# Altium schematic sheet Page06 CPU IO.SchDoc
size 513 x 386 mm
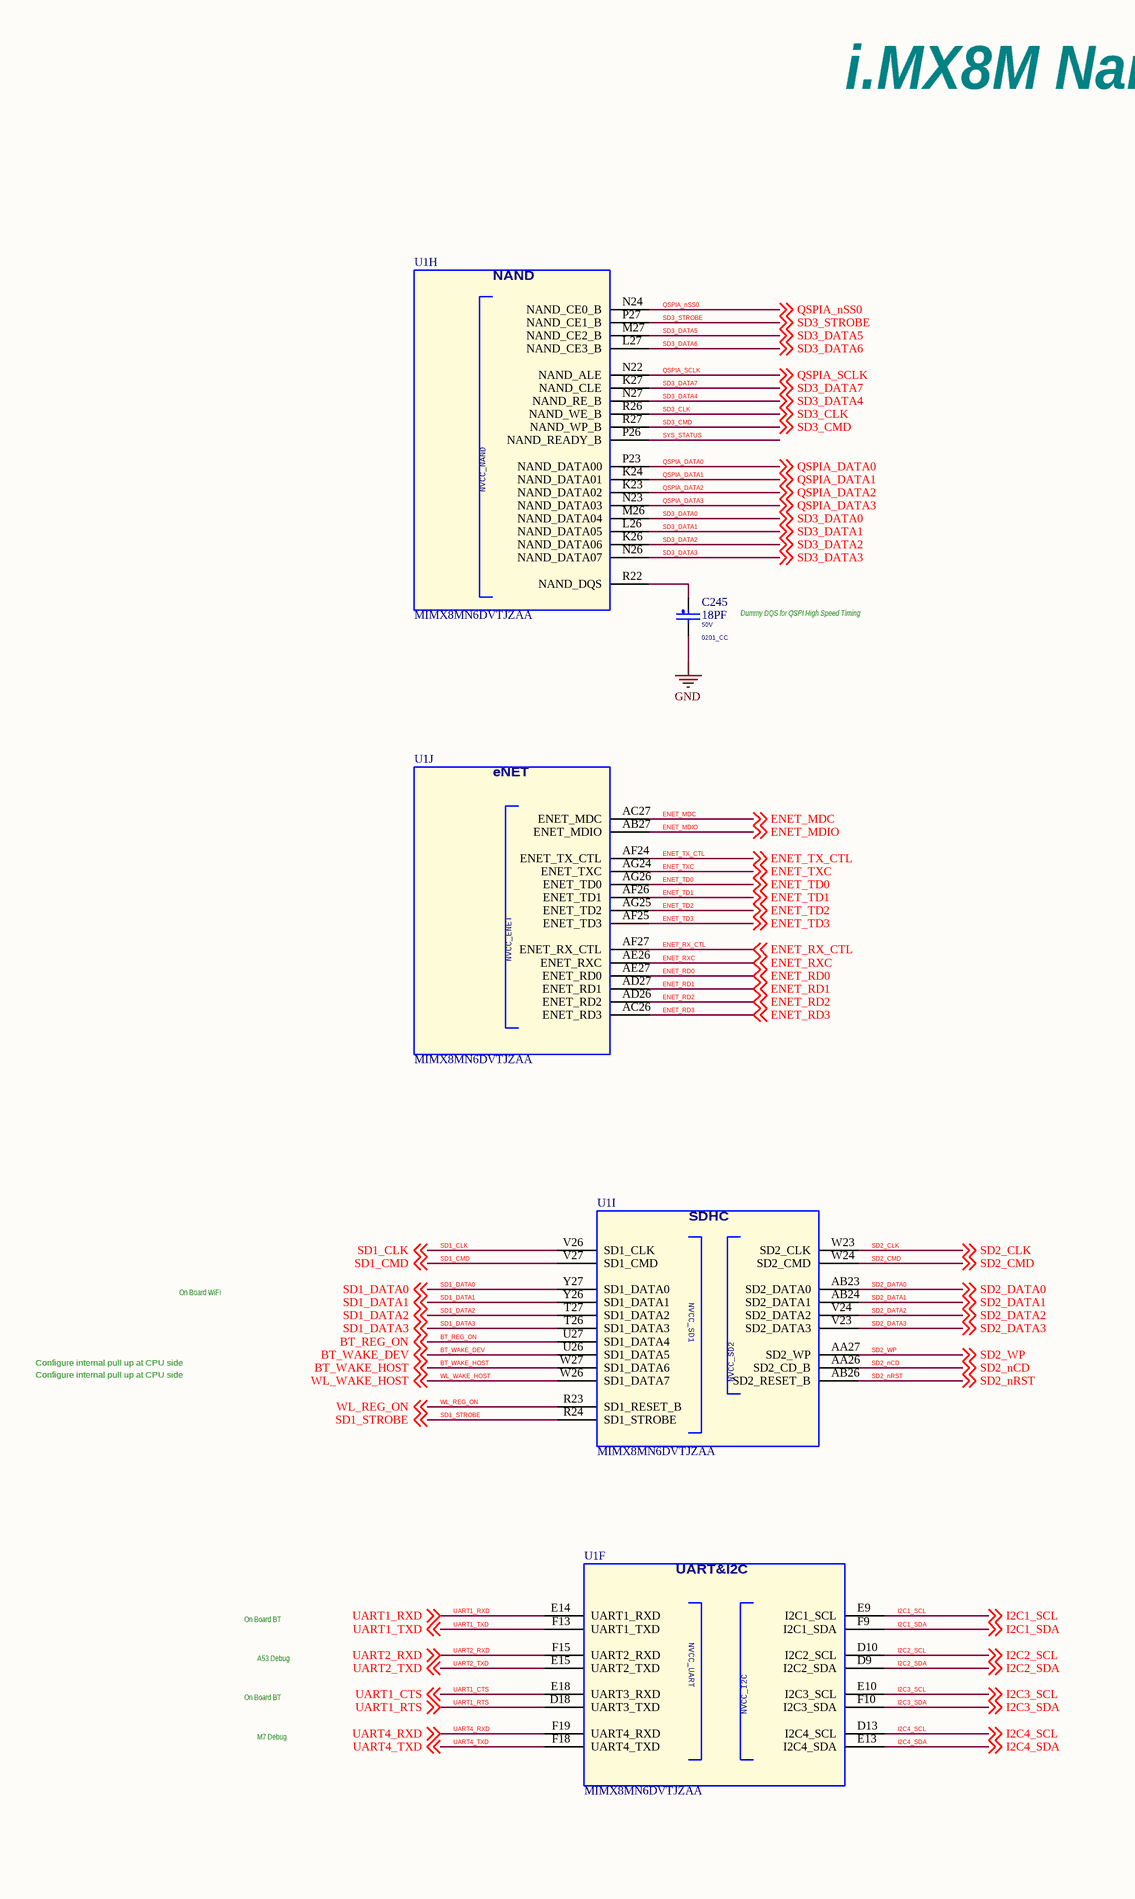
[diagram p0: Page06 CPU IO.SchDoc, left]
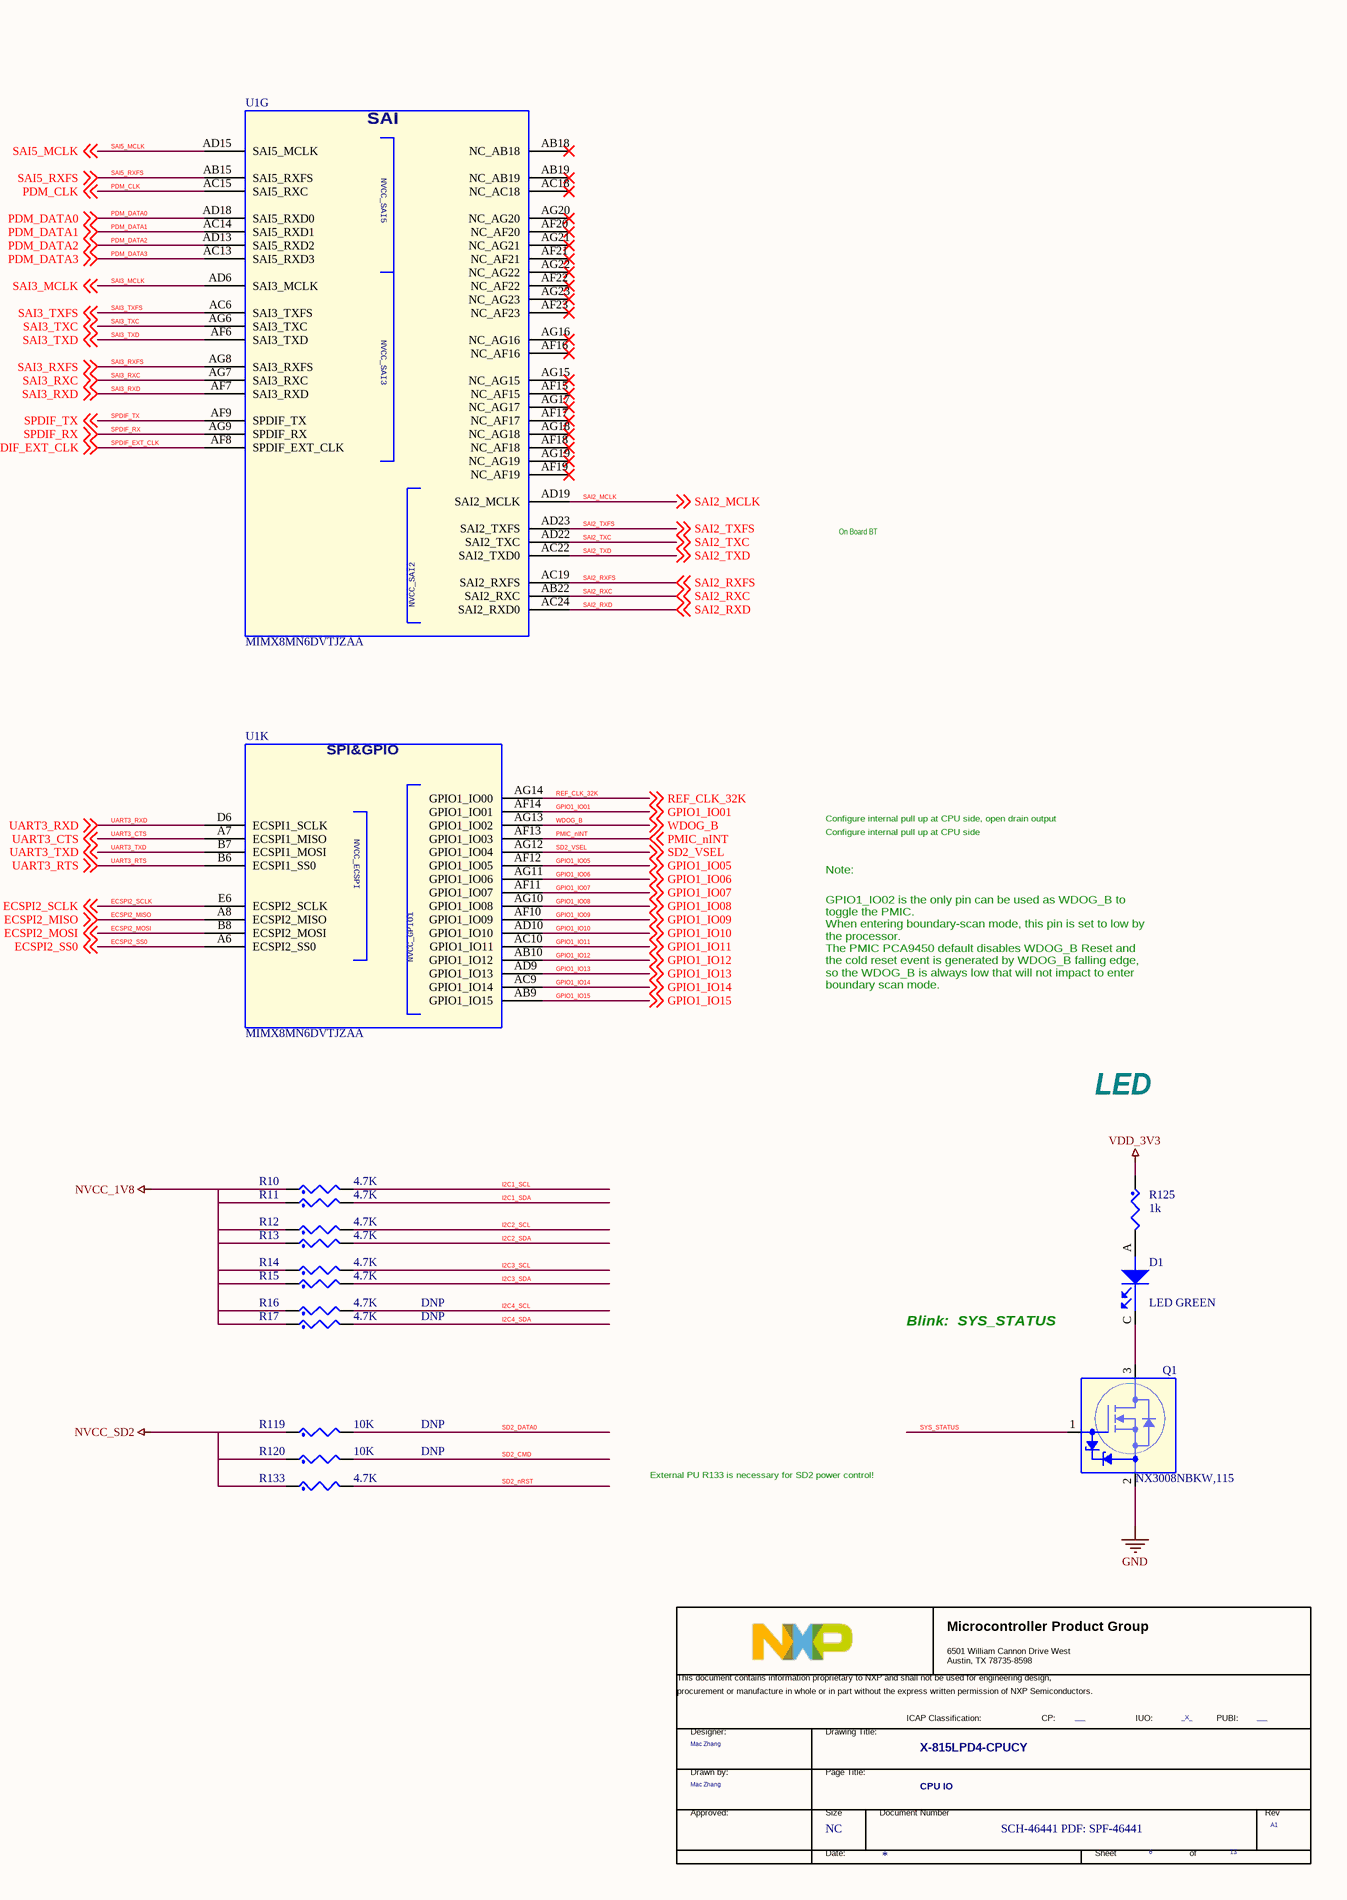
[diagram p1: Page06 CPU IO.SchDoc, right]

## Parts
*  Doc: SCH-46441 PDF: SPF-46441  RevCode: A1  Title: X-815LPD4-CPUCY  Page Size: NC  Page Number: 6  Page Count: 13  PageTitle: CPU IO  Designer: Mac Zhang  PUBI: ___  FIUO: _X_  (hidden comment: TitleBlock_MCPG)  (graphical)
C245  18PF  VOLTAGE: 50V  [0201_CC]
D1  LED GREEN  [LED_0603]
Q1  NX3008NBKW,115  [sc70_3]
R10  4.7K  [0201_CC]
R11  4.7K  [0201_CC]
R12  4.7K  [0201_CC]
R13  4.7K  [0201_CC]
R14  4.7K  [0201_CC]
R15  4.7K  [0201_CC]
R16  4.7K  ASSY_OPT: DNP  [0201_CC]
R17  4.7K  ASSY_OPT: DNP  [0201_CC]
R119  10K  ASSY_OPT: DNP  [0201_CC]
R120  10K  ASSY_OPT: DNP  [0201_CC]
R125  1k  [0201_CC]
R133  4.7K  [0201_CC]
U1  MIMX8MN6DVTJZAA  [bga486_0p5_14x14]  (parts F,G,H,I,J,K of 14)

## Nets
GND: C245.2 Q1.2(SOURCE)
NVCC_1V8: R10.1 R11.1 R12.1 R13.1 R14.1 R15.1 R16.1 R17.1
NVCC_SD2: R119.1 R120.1 R133.1
VDD_3V3: R125.1
BT_REG_ON: U1.U27(SD1_DATA4) ; off-sheet BT_REG_ON
BT_WAKE_DEV: U1.U26(SD1_DATA5) ; off-sheet BT_WAKE_DEV
BT_WAKE_HOST: U1.W27(SD1_DATA6) ; off-sheet BT_WAKE_HOST
ECSPI2_MISO: U1.A8(ECSPI2_MISO) ; off-sheet ECSPI2_MISO
ECSPI2_MOSI: U1.B8(ECSPI2_MOSI) ; off-sheet ECSPI2_MOSI
ECSPI2_SCLK: U1.E6(ECSPI2_SCLK) ; off-sheet ECSPI2_SCLK
ECSPI2_SS0: U1.A6(ECSPI2_SS0) ; off-sheet ECSPI2_SS0
ENET_MDC: U1.AC27(ENET_MDC) ; off-sheet ENET_MDC
ENET_MDIO: U1.AB27(ENET_MDIO) ; off-sheet ENET_MDIO
ENET_RD0: U1.AE27(ENET_RD0) ; off-sheet ENET_RD0
ENET_RD1: U1.AD27(ENET_RD1) ; off-sheet ENET_RD1
ENET_RD2: U1.AD26(ENET_RD2) ; off-sheet ENET_RD2
ENET_RD3: U1.AC26(ENET_RD3) ; off-sheet ENET_RD3
ENET_RX_CTL: U1.AF27(ENET_RX_CTL) ; off-sheet ENET_RX_CTL
ENET_RXC: U1.AE26(ENET_RXC) ; off-sheet ENET_RXC
ENET_TD0: U1.AG26(ENET_TD0) ; off-sheet ENET_TD0
ENET_TD1: U1.AF26(ENET_TD1) ; off-sheet ENET_TD1
ENET_TD2: U1.AG25(ENET_TD2) ; off-sheet ENET_TD2
ENET_TD3: U1.AF25(ENET_TD3) ; off-sheet ENET_TD3
ENET_TX_CTL: U1.AF24(ENET_TX_CTL) ; off-sheet ENET_TX_CTL
ENET_TXC: U1.AG24(ENET_TXC) ; off-sheet ENET_TXC
GPIO1_IO01: U1.AF14(GPIO1_IO01) ; off-sheet GPIO1_IO01
GPIO1_IO05: U1.AF12(GPIO1_IO05) ; off-sheet GPIO1_IO05
GPIO1_IO06: U1.AG11(GPIO1_IO06) ; off-sheet GPIO1_IO06
GPIO1_IO07: U1.AF11(GPIO1_IO07) ; off-sheet GPIO1_IO07
GPIO1_IO08: U1.AG10(GPIO1_IO08) ; off-sheet GPIO1_IO08
GPIO1_IO09: U1.AF10(GPIO1_IO09) ; off-sheet GPIO1_IO09
GPIO1_IO10: U1.AD10(GPIO1_IO10) ; off-sheet GPIO1_IO10
GPIO1_IO11: U1.AC10(GPIO1_IO11) ; off-sheet GPIO1_IO11
GPIO1_IO12: U1.AB10(GPIO1_IO12) ; off-sheet GPIO1_IO12
GPIO1_IO13: U1.AD9(GPIO1_IO13) ; off-sheet GPIO1_IO13
GPIO1_IO14: U1.AC9(GPIO1_IO14) ; off-sheet GPIO1_IO14
GPIO1_IO15: U1.AB9(GPIO1_IO15) ; off-sheet GPIO1_IO15
I2C1_SCL: R10.2 U1.E9(I2C1_SCL) ; off-sheet I2C1_SCL
I2C1_SDA: R11.2 U1.F9(I2C1_SDA) ; off-sheet I2C1_SDA
I2C2_SCL: R12.2 U1.D10(I2C2_SCL) ; off-sheet I2C2_SCL
I2C2_SDA: R13.2 U1.D9(I2C2_SDA) ; off-sheet I2C2_SDA
I2C3_SCL: R14.2 U1.E10(I2C3_SCL) ; off-sheet I2C3_SCL
I2C3_SDA: R15.2 U1.F10(I2C3_SDA) ; off-sheet I2C3_SDA
I2C4_SCL: R16.2 U1.D13(I2C4_SCL) ; off-sheet I2C4_SCL
I2C4_SDA: R17.2 U1.E13(I2C4_SDA) ; off-sheet I2C4_SDA
PDM_CLK: U1.AC15(SAI5_RXC) ; off-sheet PDM_CLK
PDM_DATA0: U1.AD18(SAI5_RXD0) ; off-sheet PDM_DATA0
PDM_DATA1: U1.AC14(SAI5_RXD1) ; off-sheet PDM_DATA1
PDM_DATA2: U1.AD13(SAI5_RXD2) ; off-sheet PDM_DATA2
PDM_DATA3: U1.AC13(SAI5_RXD3) ; off-sheet PDM_DATA3
PMIC_nINT: U1.AF13(GPIO1_IO03) ; off-sheet PMIC_nINT
QSPIA_DATA0: U1.P23(NAND_DATA00) ; off-sheet QSPIA_DATA0
QSPIA_DATA1: U1.K24(NAND_DATA01) ; off-sheet QSPIA_DATA1
QSPIA_DATA2: U1.K23(NAND_DATA02) ; off-sheet QSPIA_DATA2
QSPIA_DATA3: U1.N23(NAND_DATA03) ; off-sheet QSPIA_DATA3
QSPIA_nSS0: U1.N24(NAND_CE0_B) ; off-sheet QSPIA_nSS0
QSPIA_SCLK: U1.N22(NAND_ALE) ; off-sheet QSPIA_SCLK
REF_CLK_32K: U1.AG14(GPIO1_IO00) ; off-sheet REF_CLK_32K
SAI2_MCLK: U1.AD19(SAI2_MCLK) ; off-sheet SAI2_MCLK
SAI2_RXC: U1.AB22(SAI2_RXC) ; off-sheet SAI2_RXC
SAI2_RXD: U1.AC24(SAI2_RXD0) ; off-sheet SAI2_RXD
SAI2_RXFS: U1.AC19(SAI2_RXFS) ; off-sheet SAI2_RXFS
SAI2_TXC: U1.AD22(SAI2_TXC) ; off-sheet SAI2_TXC
SAI2_TXD: U1.AC22(SAI2_TXD0) ; off-sheet SAI2_TXD
SAI2_TXFS: U1.AD23(SAI2_TXFS) ; off-sheet SAI2_TXFS
SAI3_MCLK: U1.AD6(SAI3_MCLK) ; off-sheet SAI3_MCLK
SAI3_RXC: U1.AG7(SAI3_RXC) ; off-sheet SAI3_RXC
SAI3_RXD: U1.AF7(SAI3_RXD) ; off-sheet SAI3_RXD
SAI3_RXFS: U1.AG8(SAI3_RXFS) ; off-sheet SAI3_RXFS
SAI3_TXC: U1.AG6(SAI3_TXC) ; off-sheet SAI3_TXC
SAI3_TXD: U1.AF6(SAI3_TXD) ; off-sheet SAI3_TXD
SAI3_TXFS: U1.AC6(SAI3_TXFS) ; off-sheet SAI3_TXFS
SAI5_MCLK: U1.AD15(SAI5_MCLK) ; off-sheet SAI5_MCLK
SAI5_RXFS: U1.AB15(SAI5_RXFS) ; off-sheet SAI5_RXFS
SD1_CLK: U1.V26(SD1_CLK) ; off-sheet SD1_CLK
SD1_CMD: U1.V27(SD1_CMD) ; off-sheet SD1_CMD
SD1_DATA0: U1.Y27(SD1_DATA0) ; off-sheet SD1_DATA0
SD1_DATA1: U1.Y26(SD1_DATA1) ; off-sheet SD1_DATA1
SD1_DATA2: U1.T27(SD1_DATA2) ; off-sheet SD1_DATA2
SD1_DATA3: U1.T26(SD1_DATA3) ; off-sheet SD1_DATA3
SD1_STROBE: U1.R24(SD1_STROBE) ; off-sheet SD1_STROBE
SD2_CLK: U1.W23(SD2_CLK) ; off-sheet SD2_CLK
SD2_CMD: R120.2 U1.W24(SD2_CMD) ; off-sheet SD2_CMD
SD2_DATA0: R119.2 U1.AB23(SD2_DATA0) ; off-sheet SD2_DATA0
SD2_DATA1: U1.AB24(SD2_DATA1) ; off-sheet SD2_DATA1
SD2_DATA2: U1.V24(SD2_DATA2) ; off-sheet SD2_DATA2
SD2_DATA3: U1.V23(SD2_DATA3) ; off-sheet SD2_DATA3
SD2_nCD: U1.AA26(SD2_CD_B) ; off-sheet SD2_nCD
SD2_nRST: R133.2 U1.AB26(SD2_RESET_B) ; off-sheet SD2_nRST
SD2_VSEL: U1.AG12(GPIO1_IO04) ; off-sheet SD2_VSEL
SD2_WP: U1.AA27(SD2_WP) ; off-sheet SD2_WP
SD3_CLK: U1.R26(NAND_WE_B) ; off-sheet SD3_CLK
SD3_CMD: U1.R27(NAND_WP_B) ; off-sheet SD3_CMD
SD3_DATA0: U1.M26(NAND_DATA04) ; off-sheet SD3_DATA0
SD3_DATA1: U1.L26(NAND_DATA05) ; off-sheet SD3_DATA1
SD3_DATA2: U1.K26(NAND_DATA06) ; off-sheet SD3_DATA2
SD3_DATA3: U1.N26(NAND_DATA07) ; off-sheet SD3_DATA3
SD3_DATA4: U1.N27(NAND_RE_B) ; off-sheet SD3_DATA4
SD3_DATA5: U1.M27(NAND_CE2_B) ; off-sheet SD3_DATA5
SD3_DATA6: U1.L27(NAND_CE3_B) ; off-sheet SD3_DATA6
SD3_DATA7: U1.K27(NAND_CLE) ; off-sheet SD3_DATA7
SD3_STROBE: U1.P27(NAND_CE1_B) ; off-sheet SD3_STROBE
SPDIF_EXT_CLK: U1.AF8(SPDIF_EXT_CLK) ; off-sheet SPDIF_EXT_CLK
SPDIF_RX: U1.AG9(SPDIF_RX) ; off-sheet SPDIF_RX
SPDIF_TX: U1.AF9(SPDIF_TX) ; off-sheet SPDIF_TX
SYS_STATUS: Q1.1(GATE) U1.P26(NAND_READY_B)
UART1_CTS: U1.E18(UART3_RXD) ; off-sheet UART1_CTS
UART1_RTS: U1.D18(UART3_TXD) ; off-sheet UART1_RTS
UART1_RXD: U1.E14(UART1_RXD) ; off-sheet UART1_RXD
UART1_TXD: U1.F13(UART1_TXD) ; off-sheet UART1_TXD
UART2_RXD: U1.F15(UART2_RXD) ; off-sheet UART2_RXD
UART2_TXD: U1.E15(UART2_TXD) ; off-sheet UART2_TXD
UART3_CTS: U1.A7(ECSPI1_MISO) ; off-sheet UART3_CTS
UART3_RTS: U1.B6(ECSPI1_SS0) ; off-sheet UART3_RTS
UART3_RXD: U1.D6(ECSPI1_SCLK) ; off-sheet UART3_RXD
UART3_TXD: U1.B7(ECSPI1_MOSI) ; off-sheet UART3_TXD
UART4_RXD: U1.F19(UART4_RXD) ; off-sheet UART4_RXD
UART4_TXD: U1.F18(UART4_TXD) ; off-sheet UART4_TXD
WDOG_B: U1.AG13(GPIO1_IO02) ; off-sheet WDOG_B
WL_REG_ON: U1.R23(SD1_RESET_B) ; off-sheet WL_REG_ON
WL_WAKE_HOST: U1.W26(SD1_DATA7) ; off-sheet WL_WAKE_HOST
NetC245_1: C245.1 U1.R22(NAND_DQS)
NetD1_A: D1.A(ANODE) R125.2
NetD1_C: D1.C(CATHODE) Q1.3(DRAIN)

Not connected (* = marked no-connect by the designer): U1 AB18(NC_AB18)* AB19(NC_AB19)* AC18(NC_AC18)* AF15(NC_AF15)* AF16(NC_AF16)* AF17(NC_AF17)* AF18(NC_AF18)* AF19(NC_AF19)* AF20(NC_AF20)* AF21(NC_AF21)* AF22(NC_AF22)* AF23(NC_AF23)* AG15(NC_AG15)* AG16(NC_AG16)* AG17(NC_AG17)* AG18(NC_AG18)* AG19(NC_AG19)* AG20(NC_AG20)* AG21(NC_AG21)* AG22(NC_AG22)* AG23(NC_AG23)*

## Notes on the sheet
- i.MX8M Nano IO Interface
- Dummy DQS for QSPI High Speed Timing
- On Board BT
- Configure internal pull up at CPU side, open drain output
- Configure internal pull up at CPU side
- Note:
- GPIO1_IO02 is the only pin can be used as WDOG_B to
  toggle the PMIC.
  When entering boundary-scan mode, this pin is set to low by
  the processor.
  The PMIC PCA9450 default disables WDOG_B Reset and
  the cold reset event is generated by WDOG_B falling edge,
  so the WDOG_B is always low that will not impact to enter
  boundary scan mode.
- LED
- On Board WiFi
- Blink:  SYS_STATUS
- External PU R133 is necessary for SD2 power control!
- A53 Debug
- M7 Debug
- (in symbol MIMX8NN_BGA486P, part F) UART&I2C
- (in symbol MIMX8NN_BGA486P, part G) SAI
- (in symbol MIMX8NN_BGA486P, part H) NAND
- (in symbol MIMX8NN_BGA486P, part I) SDHC
- (in symbol MIMX8NN_BGA486P, part J) eNET
- (in symbol MIMX8NN_BGA486P, part K) SPI&GPIO
- (in symbol TitleBlock_MCPG) Microcontroller Product Group; 6501 William Cannon Drive West / Austin, TX 78735-8598; This document contains information proprietary to NXP and shall not be used for engineering design,; procurement or manufacture in whole or in part without the express written permission of NXP Semiconductors.; ICAP Classification:; CP:; IUO:; PUBI:; Designer:; Drawing Title:; Drawn by:; Page Title:; Approved:; Size; Document Number; Rev; Date:; Sheet; of

## Library data of the parts
* = TitleBlock_MCPG: OrgName: NXP Semiconductor; OrgAddr1: NO. 192 Liangjing Rd. Pudong New Area, ShangHai; Page Create Date: March  8, 1995; DrawnBy: Mac Zhang; FCP: ___; Page Modify Date: *
C245 = CAP_NP: CAP CER 18pF 50V 5% C0G 0201; CLASS: DISCRETE; AGILE_PN: 150-79476; MFG_NAME01: MURATA; MFG_PN01: GRM0335C1H180JA01D; CAD_APPROVED: Yes; FPLIST: CC0201,CC0201_HD,0201_CC; PCB Footprint: 0201_CC; Tolerance: 5%; ROHS: Yes; HEIGHT: 0.33MM; Package Size: 0201; Package Type: &#966;180mm Paper taping
D1 = LED: LED GRN SGL 25MA SMT 0603; CLASS: IC; CAD_APPROVED: Yes; MFG_PN01: 598-8070-107F; MFG_NAME01: DIALIGHT; AGILE_PN: 370-76672; VOLTAGE: 2V; PCB Footprint: LED_0603; HEIGHT: 0.8 MM; ROHS: Yes
Q1 = NMOS_NX3008NBK: TRAN NMOS SW 30V 350mA AEC-Q101 SC-70; CLASS: IC; AGILE_PN: 480-79736; MFG_NAME01: NEXPERIA; CAD_APPROVED: Yes; PCB Footprint: sc70_3; MFG_PN01: NX3008NBKW,115; ROHS: Yes; HEIGHT: 1.1MM; VOLTAGE: 30V
R10 R11 R14-R17 R133 = RES: RES MF 4.7K 1/20W 5% AEC-Q200 0201; CLASS: DISCRETE; FPLIST: RC0201,0201_CC; CAD_APPROVED: Yes; Temp_Range: -55C to +155C; MFG_PN01: RK73B1HTTC472J; MFG_NAME01: KOA SPEER; AGILE_PN: 470-79700; PCB Footprint: 0201_CC; HEIGHT: 0.25MM; ROHS: Yes; Tolerance: 5%; Temp Range: -55C to +155C
R12 R13 = RES: RES MF 4.7K 1/20W 5% AEC-Q200 0201; CLASS: DISCRETE; AGILE_PN: 470-79700; MFG_NAME01: KOA SPEER; MFG_PN01: RK73B1HTTC472J; Temp_Range: -55C to +155C; CAD_APPROVED: Yes; FPLIST: RC0201,0201_CC; PCB Footprint: 0201_CC; Tolerance: 5%; ROHS: Yes; HEIGHT: 0.25MM; Temp Range: -55C to +155C
R119 = RES: RES MF 10K 1/20W 5% 0201; CLASS: DISCRETE; AGILE_PN: 470-79719; MFG_NAME01: RALEC ELECTRONIC CORP; MFG_PN01: RTT01103JTH; CAD_APPROVED: Yes; FPLIST: RC0201,0201_CC; PCB Footprint: 0201_CC; Tolerance: 5%; ROHS: Yes; HEIGHT: 0.26 MM
R120 = RES: RES MF 10K 1/20W 5% 0201; CLASS: DISCRETE; FPLIST: RC0201,0201_CC; CAD_APPROVED: Yes; MFG_PN01: RTT01103JTH; MFG_NAME01: RALEC ELECTRONIC CORP; AGILE_PN: 470-79719; PCB Footprint: 0201_CC; HEIGHT: 0.26 MM; ROHS: Yes; Tolerance: 5%
R125 = RES: RES MF 1.0K OHM 1/20W 1% 30V -55+155C 0201; CLASS: DISCRETE; AGILE_PN: 470-82221; MFG_NAME01: VISHAY INTERTECHNOLOGY; MFG_PN01: CRCW02011K00FNED; Temp_Range: -55¡ãC ~ 155¡ãC; CAD_APPROVED: Yes; FPLIST: RC0201,0201_CC; VOLTAGE: 30; PCB Footprint: 0201_CC; Tolerance: 1%; ROHS: Yes; HEIGHT: 0.28MM; Temp Range: -55¡ãC ~ 155¡ãC
U1 = MIMX8NN_BGA486P: IC CPU QUAD CORTEX A53+M7 1.5GHZ BGA486; AGILE_PN: TMP-WF-35485; MFG_NAME01: NXP SEMICONDUCTORS; Temp_Range: 0¡ãC to 95¡ãC; PRE_APN: 330-77106; CAD_APPROVED: Yes; CLASS: IC; PCB Footprint: bga486_0p5_14x14; MFG_PN01: MIMX8MN6DVTJZAA; ROHS: Yes; HEIGHT: 1.25MM; Temp Range: 0¡ãC to 95¡ãC